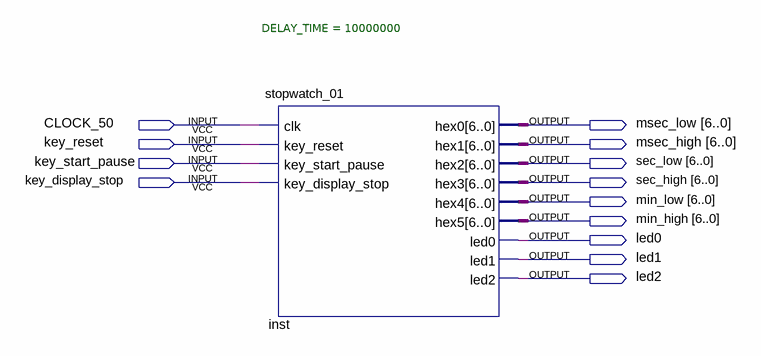
[diagram p0: schematic sheet]
// Quartus schematic stopwatch.bdf as structural Verilog: 1 symbols, 13 pins
module stopwatch (
  input  CLOCK_50,
  input  key_reset,
  input  key_start_pause,
  input  key_display_stop,
  output [6:0] msec_low,
  output [6:0] msec_high,
  output [6:0] sec_low,
  output [6:0] sec_high,
  output [6:0] min_low,
  output [6:0] min_high,
  output led0,
  output led1,
  output led2
);

  stopwatch_01 #(.DELAY_TIME(10000000)) inst (
    .clk(CLOCK_50), .key_reset(key_reset), .key_start_pause(key_start_pause),
    .key_display_stop(key_display_stop), .hex0(msec_low), .hex1(msec_high), .hex2(sec_low), .hex3(sec_high),
    .hex4(min_low), .hex5(min_high), .led0(led0), .led1(led1), .led2(led2));
endmodule
